# Altium project OpenLaser.PrjPcb
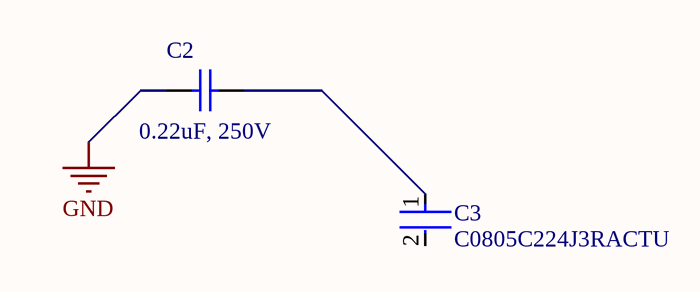
[diagram p0: OpenLaser.SchDoc]
1 sheet, 2 parts. Net scope: global (net labels, ports and power ports of the same name join across sheets).
Board file: OpenLaser.PcbDoc

## Sheet OpenLaser.SchDoc
size A4; SheetNumber: 1; SheetTotal: 1

### Parts
C2  0.22uF, 250V  [WCAP-FTBE_L10.5W6H12]
C3  C0805C224J3RACTU  [FP-C0805C-DN-MFG]

### Nets
GND: C2.1
NetC2_2: C2.2 C3.1

Not connected (* = marked no-connect by the designer): C3 2

### Library data of the parts
C2 = CMP-03913-89437297-3: Cap, 0.22Uf, 250V, Film, Radial Rohs Compliant: Yes; Pin Length: 4mm; Pitch: 7.5mm; Insulation Resistance: 9GΩ; ESR (Equivalent Series Resistance): 158mΩ; Capacitance: 220nF; Voltage Rating: 200V; Max Operating Temperature: 85°C; Length: 10.5mm; RoHS: Compliant; Height: 12mm; Min Operating Temperature: -40°C; Packaging: Carton; Width: 6mm
C3 = CMP-2007-00341-2: CAP CER 0.22UF 25V 5% X7R 0805; Manufacturer: KEMET; Value: 0.22 μF; Description: C0805 0.22 μF X7R 30ppm/°C 5.00% 25 V; Tolerance: 0.05; Temperature Coefficient: 30ppm/°C; Material: Ceramic; Height: 0.88mm; Digikey Description: CAP CER 0.22UF 25V 5% X7R 0805; Ipc Land Pattern Name: CAPC200125X78; Automotive: No; Temperature: -55°C to +125°C; Device Class L2: Capacitors; Temperature Characteristic: X7R; Category: Cap; ComponentLink2Description: Datasheet; Manufacturer Part Number: C0805C224J3RACTU; Voltage Rating: 25 V; Package: C0805C-DN; Mouser Description: Multilayer Ceramic Capacitors MLCC - SMD/SMT 25volts 0.22uF X7R 5%; Device Class L3: Ceramic Capacitors; Octopart: https://octopart.com/c0805c224j3ractu-kemet-8375770; Device Class L1: Passive Components; RoHS: TRUE; Temperature Range High: +125°C; Lead Free: Yes; ComponentLink2URL: https://content.kemet.com/datasheets/KEM_C1003_C0G_SMD.pdf; Capacitance: 0.22 μF; Temperature Range Low: -55°C